# Altium schematic sheet CANTransceiver.SchDoc
size A4
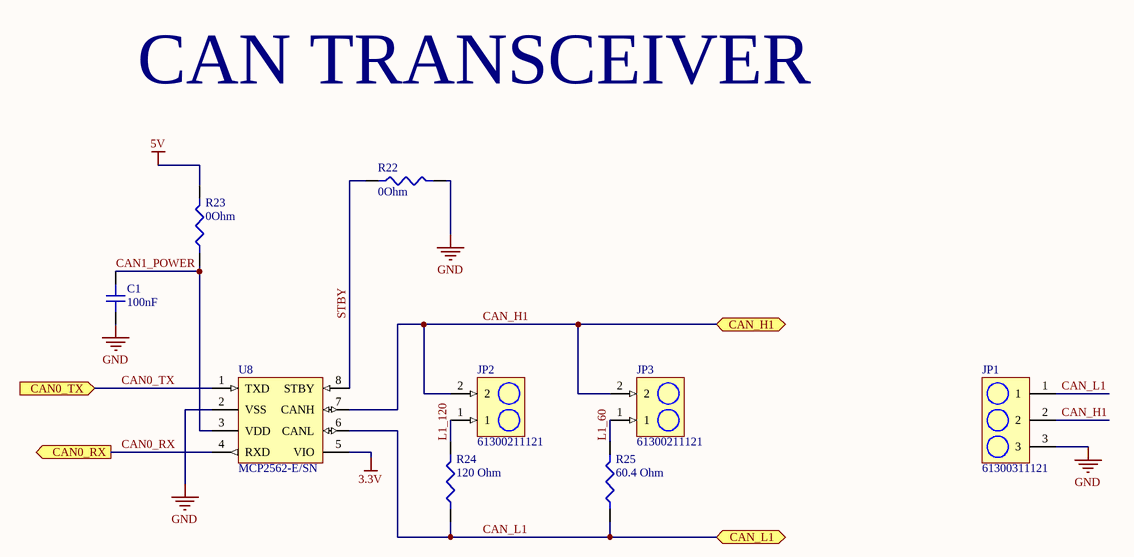
[diagram p0: CANTransceiver.SchDoc]

## Parts
C1  100nF  [CAPC1608X10N]
JP1  61300311121  [61300311121]
JP2  61300211121  [61300211121]
JP3  61300211121  [61300211121]
R22  0Ohm  [RES-0603]
R23  0Ohm  [RES-0603]
R24  120 Ohm  [RESC1608X06N]
R25  60.4 Ohm  [60.4 OHM RES 0603]
U8  MCP2562-E/SN  [SOIC127P600X175-8N]

## Ports
CAN0_RX (out), CAN0_TX (in), CAN_H1 (bidir), CAN_L1 (bidir)

## Nets
3.3V: U8.5(VIO)
5V: R23.2
GND: C1.1 JP1.3 R22.2 U8.2(VSS)
CAN0_RX: U8.4(RXD) ; port CAN0_RX
CAN0_TX: U8.1(TXD) ; port CAN0_TX
CAN1_POWER: C1.2 R23.1 U8.3(VDD)
CAN_H1: JP1.2 JP2.2 JP3.2 U8.7(CANH) ; port CAN_H1
CAN_L1: JP1.1 R24.1 R25.1 U8.6(CANL) ; port CAN_L1
L1_60: JP3.1 R25.2
L1_120: JP2.1 R24.2
STBY: R22.1 U8.8(STBY)

## Notes on the sheet
- CAN TRANSCEIVER

## Library data of the parts
C1 = C0603C104K4RAC7411: Cap Ceramic 0.1uF 16V X7R 10% SMD 0603 125C Paper T/R; Manufacturer: KEMET; Dissipation Factor: 3.5%; Supplier 1: Digi-Key; Manufacturer Part Number: C0603C104K4RAC7411; Stock 1: 26049; Pricing 1: 1=0.14000, 10=0.09800, 100=0.04620, 500=0.03240, 1000=0.02683, 2500=0.02497, 5000=0.02285 (USD); RoHS: Yes; Mount: Surface Mount; Case/Package: 0603; Case Code (Imperial): 0603; Case Code (Metric): 1608; Dielectric Material: Ceramic; Min Operating Temperature: -55°C; Max Operating Temperature: 125°C; Tolerance: 10%; Packaging: Tape and Reel; Capacitance: 100nF; Package Quantity: 10000; Voltage Rating: 16V; Voltage Rating (DC): 16V; Dielectric: X7R; Termination: SMD/SMT; Length: 1.6mm; Height: 0.8mm; Width: 0.8mm; Lead Pitch: 0.7mm; Depth: 0.8mm; Radiation Hardening: No; ComponentLink1URL: https://datasheet.ciiva.com/5411/kem-c1002-x7r-smd-357932-5411657.pdf?src-supplier=Mouser; ComponentLink1Description: https://datasheet.ciiva.com/5411/kem-c1002-x7r-smd-357932-5411657.pdf?src-supplier=Mouser; Supplier Part Number 1: 399-17393-1-ND
JP1 = 61300311121: WURTH ELEKTRONIK - 61300311121 - HEADER, 2.54MM, PIN, THT, VERTICAL, 3WAY; Manufacturer: Wurth Electronics; Number of Positions: 3; Gender: Male; Connector Type: Male Pin; Pitch: 0.1inch; Supplier 1: Digi-Key; Manufacturer Part Number: 61300311121; Stock 1: 56311; Pricing 1: 1=0.13000, 10=0.10600, 25=0.08800, 50=0.07400, 100=0.06700, 1000=0.06100 (USD); RoHS: Yes; Mount: Through Hole; Contact Plating: Gold; Contact Material: Copper; Color: Black; Number of Rows: 1; Packaging: Bulk; Termination: Solder; Number of Contacts: 3; Contact Mating Length: 0.236inch; REACH SVHC: Unknown; Lead Free: Lead Free; ComponentLink1URL: http://www.farnell.com/cad/1737268.pdf?src-supplier=Element14; ComponentLink1Description: http://www.farnell.com/cad/1737268.pdf?src-supplier=Element14; ComponentLink2URL: https://katalog.we-online.de/em/datasheet/6130xx11121.pdf?src-supplier=Digi-Key; ComponentLink2Description: https://katalog.we-online.de/em/datasheet/6130xx11121.pdf?src-supplier=Digi-Key; Supplier Part Number 1: 732-5316-ND
JP2 JP3 = 61300211121: Headers & Wire Housings WR-PHD 2.54mm 2Pin THT Header; Manufacturer: Wurth Electronics; Current Rating: 3A; Voltage Rating: 250V; Number of Positions: 2; Gender: Male; Connector Type: Male Pin; Pitch: 0.1inch; Supplier 1: Digi-Key; Manufacturer Part Number: 61300211121; Stock 1: 191551; Pricing 1: 1=0.13000, 10=0.10600, 25=0.08800, 50=0.07400, 100=0.06700, 1000=0.06100 (USD); RoHS: Yes; Mount: Through Hole; Contact Plating: Gold; Housing Material: PBT; Contact Material: Copper Alloy,Copper; Color: Black; Min Operating Temperature: -40°C; Max Operating Temperature: 125°C; Number of Rows: 1; Contact Gender: Male; Packaging: Bulk; Termination: Through Hole; Number of Contacts: 2; Contact Mating Length: 0.236inch; REACH SVHC: Unknown; Lead Free: Lead Free; ComponentLink1URL: https://datasheet.ciiva.com/13619/6130xx11121-48870-13619345.pdf?src-supplier=Mouser; ComponentLink1Description: https://datasheet.ciiva.com/13619/6130xx11121-48870-13619345.pdf?src-supplier=Mouser; Supplier Part Number 1: 732-5315-ND
R22 R23 = RC0603JR-070RL: RES SMD 0 OHM JUMPER 1/10W 0603; Manufacturer: Yageo; Resistance: 0mR; Tolerance: 1%; Voltage Rating: 50V; Power Rating: 100mW; Temperature Coefficient: 200ppm/°C; Supplier 1: Digi-Key; Manufacturer Part Number: RC0603JR-070RL; Stock 1: 36135548; Pricing 1: 1=0.10000, 10=0.01900, 25=0.01360, 50=0.01040, 100=0.00770, 250=0.00588, 500=0.00472, 1000=0.00347 (USD); RoHS: Yes; Case/Package: 0603; Number of Pins: 2; Case Code (Imperial): 0603; Case Code (Metric): 1608; Contact Plating: Tin,Matte; Min Operating Temperature: -55°C; Max Operating Temperature: 155°C; Package Quantity: 5000; Packaging: Tape and Reel; Voltage Rating (DC): 50V; Termination: SMD/SMT; Composition: Thick Film; Military Standard: Not; Length: 1.6mm; Height: 0.45mm; Width: 0.8mm; Depth: 0.8mm; Radiation Hardening: No; REACH SVHC: No SVHC; Lead Free: Lead Free; ComponentLink1URL: https://datasheet.ciiva.com/11808/pyu-r-int-6-11808700.pdf?src-supplier=RSComponents; ComponentLink1Description: https://datasheet.ciiva.com/11808/pyu-r-int-6-11808700.pdf?src-supplier=RSComponents; ComponentLink2URL: https://datasheet.ciiva.com/7746/1738695-7746421.pdf?src-supplier=Element14; ComponentLink2Description: https://datasheet.ciiva.com/7746/1738695-7746421.pdf?src-supplier=Element14; ComponentLink3URL: https://datasheet.ciiva.com/8883/pyu-rc0603-51-rohs-l-4-8883045.pdf?src-supplier=Avnet; ComponentLink3Description: https://datasheet.ciiva.com/8883/pyu-rc0603-51-rohs-l-4-8883045.pdf?src-supplier=Avnet; ComponentLink4URL: https://datasheet.ciiva.com/15189/getdatasheetpartid-329462-15189845.pdf?src-supplier=Verical; ComponentLink4Description: https://datasheet.ciiva.com/15189/getdatasheetpartid-329462-15189845.pdf?src-supplier=Verical; ComponentLink5URL: https://datasheet.ciiva.com/7746/1738695-7746422.pdf?src-supplier=Element14; ComponentLink5Description: https://datasheet.ciiva.com/7746/1738695-7746422.pdf?src-supplier=Element14; ComponentLink6URL: https://datasheet.ciiva.com/12555/rc0603-272842-12555254.pdf?src-supplier=Mouser; ComponentLink6Description: https://datasheet.ciiva.com/12555/rc0603-272842-12555254.pdf?src-supplier=Mouser; ComponentLink7URL: https://datasheet.ciiva.com/22747/443971-22747530.pdf?src-supplier=Element14; ComponentLink7Description: https://datasheet.ciiva.com/22747/443971-22747530.pdf?src-supplier=Element14; Supplier Part Number 1: 311-0.0GRCT-ND
R24 = ERA-3AEB121V: Metal film resistor 120 Ω SMD 0603 0.1 W; Manufacturer: Panasonic; Resistance: 120R; Power Rating: 100mW; Tolerance: 0.1%; Voltage Rating: 75V; Temperature Coefficient: 25ppm/°C; Supplier 1: Digi-Key; Manufacturer Part Number: ERA-3AEB121V; Stock 1: 121177; Pricing 1: 1=0.35000, 10=0.30000, 100=0.11730, 1000=0.04908, 2500=0.04499 (USD); RoHS: Yes; Mount: Surface Mount; Case/Package: 0603; Number of Pins: 2; Case Code (Metric): 1608; Case Code (Imperial): 0603; Contact Plating: Tin; Min Operating Temperature: -55°C; Max Operating Temperature: 155°C; Packaging: Tape and Reel; Package Quantity: 1; Composition: Thin Film; Number of Terminations: 2; Termination: SMD/SMT; Military Standard: Not; Max Power Dissipation: 100mW; Voltage Rating (DC): 75V; Features: Automotive AEC-Q200; Length: 1.6mm; Height: 0.45mm; Width: 0.8mm; Depth: 0.8mm; Radiation Hardening: No; REACH SVHC: No SVHC; Lead Free: Lead Free; ComponentLink1URL: https://datasheet.ciiva.com/11808/0900766b80fe20f7-11808026.pdf?src-supplier=RSComponents; ComponentLink1Description: https://datasheet.ciiva.com/11808/0900766b80fe20f7-11808026.pdf?src-supplier=RSComponents; ComponentLink2URL: https://datasheet.ciiva.com/22737/1776116-22737254.pdf?src-supplier=Element14; ComponentLink2Description: https://datasheet.ciiva.com/22737/1776116-22737254.pdf?src-supplier=Element14; ComponentLink3URL: https://datasheet.ciiva.com/30214/54aoa0000ce26-30214359.pdf?src-supplier=Onlinecomponents.com; ComponentLink3Description: https://datasheet.ciiva.com/30214/54aoa0000ce26-30214359.pdf?src-supplier=Onlinecomponents.com; ComponentLink4URL: https://datasheet.ciiva.com/48425/era-eng-tds-48425415.pdf?src-supplier=Distrelec; ComponentLink4Description: https://datasheet.ciiva.com/48425/era-eng-tds-48425415.pdf?src-supplier=Distrelec; ComponentLink5URL: https://datasheet.ciiva.com/5999/485442-5999048.pdf?src-supplier=Farnell; ComponentLink5Description: https://datasheet.ciiva.com/5999/485442-5999048.pdf?src-supplier=Farnell; ComponentLink6URL: https://datasheet.ciiva.com/43455/485442-43455209.pdf?src-supplier=Farnell; ComponentLink6Description: https://datasheet.ciiva.com/43455/485442-43455209.pdf?src-supplier=Farnell; ComponentLink7URL: https://datasheet.ciiva.com/43457/485442-43457753.pdf?src-supplier=Farnell; ComponentLink7Description: https://datasheet.ciiva.com/43457/485442-43457753.pdf?src-supplier=Farnell; ComponentLink8URL: https://datasheet.ciiva.com/48534/era-eng-tds-48534505.pdf?src-supplier=Distrelec; ComponentLink8Description: https://datasheet.ciiva.com/48534/era-eng-tds-48534505.pdf?src-supplier=Distrelec; ComponentLink9URL: https://datasheet.ciiva.com/5999/485442-5999050.pdf?src-supplier=Farnell; ComponentLink9Description: https://datasheet.ciiva.com/5999/485442-5999050.pdf?src-supplier=Farnell; ComponentLink10URL: https://datasheet.ciiva.com/9117/aoa0000ce26-9117338.pdf?src-supplier=Avnet; ComponentLink10Description: https://datasheet.ciiva.com/9117/aoa0000ce26-9117338.pdf?src-supplier=Avnet; ComponentLink11URL: https://datasheet.ciiva.com/9186/aoa0000ce26-9186155.pdf?src-supplier=Avnet; ComponentLink11Description: https://datasheet.ciiva.com/9186/aoa0000ce26-9186155.pdf?src-supplier=Avnet; Supplier Part Number 1: P120DBCT-ND
R25 = RMCF0603FT60R4: RES 60.4 OHM 1% 1/10W 0603; Manufacturer: Stackpole Electronics; Resistance: 60.4R; Max Power Dissipation: 100mW; Temperature Coefficient: 100ppm/°C; Supplier 1: Digi-Key; Manufacturer Part Number: RMCF0603FT60R4; Stock 1: 27338; Pricing 1: 1=0.10000, 10=0.01600, 100=0.00650, 1000=0.00292, 2500=0.00253 (USD); RoHS: Yes; Mount: Surface Mount; Case/Package: 0603; Case Code (Metric): 1608; Case Code (Imperial): 0603; Contact Plating: Tin,Matte; Min Operating Temperature: -55°C; Max Operating Temperature: 155°C; Packaging: Tape and Reel; Tolerance: 1%; Composition: Thick Film; Number of Terminations: 2; Features: Automotive AEC-Q200; Length: 0.061inch; Height: 0.022inch; Width: 0.031inch; Radiation Hardening: No; Lead Free: Lead Free; ComponentLink1URL: http://components.arrow.com/part/dataview/50499519S121523N1174?src-supplier=Arrow; ComponentLink1Description: http://components.arrow.com/part/dataview/50499519S121523N1174?src-supplier=Arrow; ComponentLink2URL: https://www.seielect.com/catalog/SEI-RMCF_RMCP.pdf?src-supplier=Avnet; ComponentLink2Description: https://www.seielect.com/catalog/SEI-RMCF_RMCP.pdf?src-supplier=Avnet; ComponentLink3URL: https://www.seielect.com/catalog/SEI-Packaging.pdf?src-supplier=Digi-Key; ComponentLink3Description: https://www.seielect.com/catalog/SEI-Packaging.pdf?src-supplier=Digi-Key; Supplier Part Number 1: RMCF0603FT60R4CT-ND
U8 = MCP2562-E/SN: Interface IC CAN SO-8; Manufacturer: Microchip; Number of Transmit Buffers: 1; Min Supply Voltage: 4.5V; Max Supply Voltage: 5.5V; Data Rate: 1Mbps; Nominal Supply Current: 70mA; Propagation Delay: 125ns; Interface: CAN,LIN; Logic Function: Transceiver; Supplier 1: Digi-Key; Manufacturer Part Number: MCP2562-E/SN; Stock 1: 3084; Pricing 1: 1=0.90000, 25=0.75000, 100=0.68000 (USD); RoHS: Yes; Mount: Surface Mount; Case/Package: SOIC; Number of Pins: 8; Min Operating Temperature: -40°C; Max Operating Temperature: 125°C; Number of Receive Buffers: 1; Packaging: Rail/Tube; Number of Receivers: 1; Package Quantity: 100; Turn-On Delay Time: 125ns; Number of Transceivers: 1; Max Supply Current: 70mA; Number of Drivers: 1; Length: 4.9mm; Height: 1.5mm; Width: 3.9mm; Radiation Hardening: No; REACH SVHC: No SVHC; Lead Free: Lead Free; ComponentLink1URL: https://datasheet.ciiva.com/26922/getdatasheetpartid-776214-26922473.pdf?src-supplier=Verical; ComponentLink1Description: https://datasheet.ciiva.com/26922/getdatasheetpartid-776214-26922473.pdf?src-supplier=Verical; ComponentLink2URL: https://datasheet.ciiva.com/24192/filehandler-aspxddocname-en561044-24192158.pdf?src-supplier=Future+Electronics; ComponentLink2Description: https://datasheet.ciiva.com/24192/filehandler-aspxddocname-en561044-24192158.pdf?src-supplier=Future+Electronics; ComponentLink3URL: https://datasheet.ciiva.com/39123/21125167b-39123503.pdf?src-supplier=Onlinecomponents.com; ComponentLink3Description: https://datasheet.ciiva.com/39123/21125167b-39123503.pdf?src-supplier=Onlinecomponents.com; ComponentLink4URL: https://datasheet.ciiva.com/22747/1755821-22747911.pdf?src-supplier=Element14; ComponentLink4Description: https://datasheet.ciiva.com/22747/1755821-22747911.pdf?src-supplier=Element14; ComponentLink5URL: https://datasheet.ciiva.com/18624/25167b-18624808.pdf?src-supplier=Digi-Key; ComponentLink5Description: https://datasheet.ciiva.com/18624/25167b-18624808.pdf?src-supplier=Digi-Key; ComponentLink6URL: https://datasheet.ciiva.com/29898/25167b-29898006.pdf?src-supplier=Avnet; ComponentLink6Description: https://datasheet.ciiva.com/29898/25167b-29898006.pdf?src-supplier=Avnet; ComponentLink7URL: https://datasheet.ciiva.com/48512/mcp2562-eng-tds-48512071.pdf?src-supplier=Distrelec; ComponentLink7Description: https://datasheet.ciiva.com/48512/mcp2562-eng-tds-48512071.pdf?src-supplier=Distrelec; Supplier Part Number 1: MCP2562-E/SN-ND